# Altium schematic sheet Power Supply.SchDoc: Power Supply
size Letter; Author: Alfredo Cortellini; Organization: IT Logic; Address1: 5753 Highway 85 N; Address2: Crestview, FL 32536; Address3: United States; DocumentNumber: 6; SheetNumber: 6; SheetTotal: 6; Email: pcb-design@itlogic.cloud
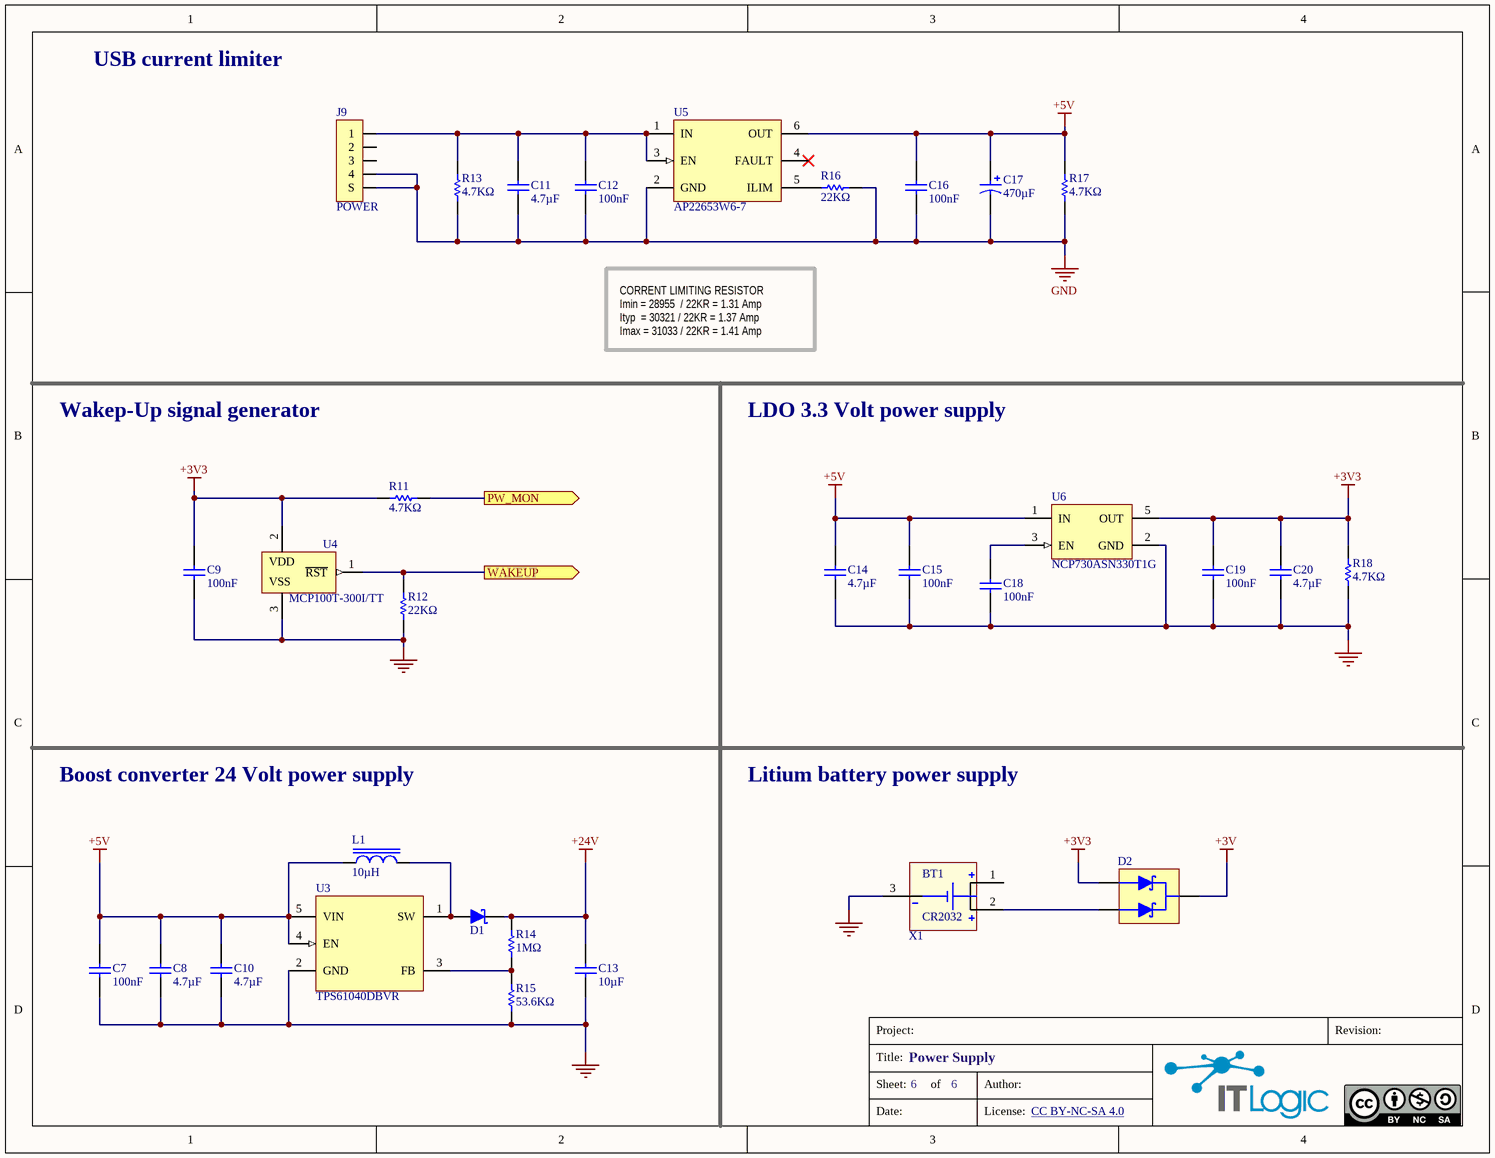
[diagram p0: Power Supply.SchDoc]

## Parts
BT1  CR2032  (mechanical)
C7  100nF  [C0603-H90]
C8  4.7µF  [C0603-H90]
C9  100nF  [C0603-H90]
C10  4.7µF  [C0603-H90]
C11  4.7µF  [C0603-H90]
C12  100nF  [C0603-H90]
C13  10µF  [C1210-H250]
C14  4.7µF  [C0603-H90]
C15  100nF  [C0603-H90]
C16  100nF  [C0603-H90]
C17  470µF  [C-AE-D8-H102]
C18  100nF  [C0603-H90]
C19  100nF  [C0603-H90]
C20  4.7µF  [C0603-H90]
D1  ZLLS400QTC  [SOD-323]  (value not drawn)
D2  BAT5405E6327HTSA1  [SOT-23]  (value not drawn)
J9  POWER  [67068-8000]
L1  10µH  [IND-LQH43CN]
R11  4.7KΩ  [R0603-H55]
R12  22KΩ  [R0603-H55]
R13  4.7KΩ  [R0603-H55]
R14  1MΩ  [R0603-H55]
R15  53.6KΩ  [R0603-H55]
R16  22KΩ  [R0603-H55]
R17  4.7KΩ  [R0603-H55]
R18  4.7KΩ  [R0603-H55]
U3  TPS61040DBVR  [SOT-235]
U4  MCP100T-300I/TT  [SOT-23]
U5  AP22653W6-7  [SOT-236]
U6  NCP730ASN330T1G  [SOT-235]
X1  BAT-HLD-001  [BATT-TRAY-2032]  (value not drawn)

## Ports
PW_MON (out), WAKEUP (out)

## Nets
+3V: D2.3(K)
+3V3: C9.2 C19.2 C20.2 D2.1(A) R11.2 R18.2 U4.2(VDD) U6.5(OUT)
+5V: C7.2 C8.2 C10.2 C14.2 C15.2 C16.2 C17.1 L1.1 R17.2 U3.4(EN) U3.5(VIN) U5.6(OUT) U6.1(IN)
+24V: C13.2 D1.1(K) R14.2
GND: C7.1 C8.1 C9.1 C10.1 C11.1 C12.1 C13.1 C14.1 C15.1 C16.1 C17.2 C18.1 C19.1 C20.1 J9.4 J9.S R12.1 R13.1 R15.1 R16.2 R17.1 R18.1 U3.2(GND) U4.3(VSS) U5.2(GND) U6.2(GND) X1.3(-)
PW_MON: R11.1 ; port PW_MON
WAKEUP: R12.2 U4.1(~{RST}) ; port WAKEUP
NetC11_2: C11.2 C12.2 J9.1 R13.2 U5.1(IN) U5.3(EN)
NetC18_2: C18.2 U6.3(EN)
NetD1_2: D1.2(A) L1.2 U3.1(SW)
NetD2_2: D2.2(A) X1.2(+)
NetR14_1: R14.1 R15.2 U3.3(FB)
NetR16_1: R16.1 U5.5(ILIM)

Not connected (* = marked no-connect by the designer): J9 2 3; U5 4(FAULT)*; X1 1(+)

## Notes on the sheet
- USB current limiter
- CORRENT LIMITING RESISTOR
  Imin = 28955  / 22KR = 1.31 Amp
  Ityp  = 30321 / 22KR = 1.37 Amp
  Imax = 31033 / 22KR = 1.41 Amp
- Wakep-Up signal generator
- LDO 3.3 Volt power supply
- Boost converter 24 Volt power supply
- Litium battery power supply
- Project:
- Revision:
- Title:
- Sheet:
- of
- Author:
- Date:
- License:
- CC BY-NC-SA 4.0 <https://creativecommons.org/licenses/by-nc-sa/4.0/>

## Library data of the parts
BT1 = CR2032: Battery Lithium 3V Coin 20mm; Manufacturer: Panasonic BSG; Manufacturer Part Number: CR2032; Mount: Free Hanging; Voltage Rating: 3V; ComponentLink1URL: https://datasheet.ciiva.com/2/crseries-datasheets-merged-2903.pdf; ComponentLink1Description: Data Sheet
C7 C9 C12 C15 C16 C18 C19 = CGA3E2X7R1H104K080AA: Cap 0603 Case Ceramic 100nF 50V X7R; Manufacturer: TDK; Value: 100n; Manufacturer Part Number: CGA3E2X7R1H104K080AA; Mount: Surface Mount; Case: 0603; Capacitance: 100nF; Dielectric: X7R; Voltage Rating: 50V; ComponentLink1URL: https://product.tdk.com/system/files/dam/doc/product/capacitor/ceramic/mlcc/catalog/mlcc_commercial_general_en.pdf; ComponentLink1Description: Data Sheet
C8 C10 C11 C14 C20 = C1608X7S1A475K080AC: Cap 0603 Case Ceramic 4.7uF 10V X7S; Manufacturer: TDK; Voltage Rating: 50V; Value: 4.7u; Manufacturer Part Number: C1608X7S1A475K080AC; Mount: Surface Mount; Case: 0603; Capacitance: 4.7uF; Dielectric: X7S; ComponentLink1URL: https://product.tdk.com/system/files/dam/doc/product/capacitor/ceramic/mlcc/catalog/mlcc_commercial_general_en.pdf; ComponentLink1Description: Data Sheet
C13 = CL32B106KBJNNWE: Cap 1210 Case Ceramic 10uF 50V X7R 10%; Manufacturer: Samsung; Dielectric: X7S; Value: 10u; Manufacturer Part Number: CL32B106KBJNNWE; Mount: Surface Mount; Case: 1210; Capacitance: 10uF; Voltage Rating: 50V; ComponentLink1URL: https://www.mouser.com/datasheet/2/585/MLCC-1837944.pdf; ComponentLink1Description: Data Sheet
C17 = EEE-FK1C471P: Cap Electrolytic Alu 470uF 16V 20% (10 X 10.2mm) SMD 600mA 2000h 105C Automotive T/R; Manufacturer: Panasonic; Resistance: 0.16R; Value: 470u; Manufacturer Part Number: EEE-FK1C471P; Mount: Surface Mount; Capacitance: 470uF; Voltage Rating: 16V; ComponentLink1URL: https://datasheet.ciiva.com/3773/41677623s8437994n1386-3773397.pdf; ComponentLink1Description: Data Sheet; Case: F
D1 = ZLLS400QTC: Diode Schottky 40V 0.5A, Vf 480mV, 2-Pin SOD323; Manufacturer: Diodes Incorporated; Manufacturer Part Number: ZLLS400QTC; Mount: Surface Mount; Case: SOD323; Current Rating: 0.5A; ComponentLink1URL: https://eu.mouser.com/datasheet/2/115/ZLLS400Q-959647.pdf; ComponentLink1Description: Data Sheet
D2 = BAT5405E6327HTSA1: Diode Schottky, Common cathode, 40V 0.3A 3-Pin SOT-323; Manufacturer: Infineon Technologies; Manufacturer Part Number: BAT5405E6327HTSA1; Mount: Surface Mount; Case: SOT-23; Current Rating: 0.3A; ComponentLink1URL: https://www.infineon.com/dgdl/Infineon-BAT54SERIES-DS-v01_01-en.pdf?fileId=db3a304314dca3890115190b74210ea6; ComponentLink1Description: Data Sheet
J9 = 67068-8000: Conn USB Type B Right-Angle, Kinked Solder Tabs; Manufacturer: Molex; Voltage Rating: 30V; Current Rating: 1.5A; Manufacturer Part Number: 67068-8000; Mount: Through Hole; ComponentLink1URL: https://www.molex.com/pdm_docs/sd/670688000_sd.pdf; ComponentLink1Description: Data Sheet
L1 = LQH43CN100K03L: Inductor Power LQH43CN Series, 10uH, 0.65 A, 0.24 ohm, SMD; Manufacturer: Murata; Value: 10u; Manufacturer Part Number: LQH43CN100K03L; Inductance: 10µH; ComponentLink1URL: https://search.murata.co.jp/Ceramy/image/img/P02/JELF243A-0042.pdf; ComponentLink1Description: Data Sheet; Mount: Surface Mount
R11 R13 R17 R18 = RC0603FR-074K7L: Resistor 0603 Case 4.7KR 1% 1/10W; Manufacturer: Yageo; Voltage Rating: 150V; Value: 4.7K; Manufacturer Part Number: RC0603FR-074K7L; Case: 0603; Resistance: 4.7kR; ComponentLink1URL: https://datasheet.ciiva.com/11808/0900766b8106beab-11808155.pdf; ComponentLink1Description: Data Sheet; Mount: Surface Mount
R12 R16 = RC0603FR-0722KL: Resistor 0603 Case 22KR 1% 1/10W; Manufacturer: Yageo; Voltage Rating: 150V; Value: 22K; Manufacturer Part Number: RC0603FR-0722KL; Case: 0603; Resistance: 22kR; ComponentLink1URL: https://datasheet.ciiva.com/2457/pyu-r-int-thick-7-2457521.pdf; ComponentLink1Description: Data Sheet; Mount: Surface Mount
R14 = RC0603FR-071ML: Resistor 0603 Case 1MR 1% 1/10W; Manufacturer: Yageo; Voltage Rating: 150V; Value: 1M; Manufacturer Part Number: RC0603FR-071ML; Case: 0603; Resistance: 1MR; ComponentLink1URL: https://datasheet.ciiva.com/2519/pyu-r-int-thick-7-2519712.pdf; ComponentLink1Description: Data Sheet; Mount: Surface Mount
R15 = RC0603FR-0753K6L: Resistor 0603 Case 53.6KR 1% 1/10W; Manufacturer: Yageo; Voltage Rating: 150V; Value: 53.6K; Manufacturer Part Number: RC0603FR-0753K6L; Case: 0603; Resistance: 53.6kR; ComponentLink1URL: https://datasheet.ciiva.com/2457/pyu-r-int-thick-7-2457521.pdf; ComponentLink1Description: Data Sheet; Mount: Surface Mount
U3 = TPS61040DBVR: Conv DC-DC Sync Step-Up 28V .45A 1MHz SOT-23-5; Manufacturer: Texas Instruments; Manufacturer Part Number: TPS61040DBVR; Mount: Surface Mount; Case: STO-235; ComponentLink1URL: http://www.ti.com/lit/ds/symlink/tps54308.pdf; ComponentLink1Description: Data Sheet
U4 = MCP100T-300I/TT: Power Supervisor 3.00V Low SOT23; Manufacturer: Microchip; Manufacturer Part Number: MCP100T-300I/TT; Mount: Surface Mount; Case: SOT-23-3; ComponentLink1URL: https://ww1.microchip.com/downloads/en/DeviceDoc/11187f.pdf; ComponentLink1Description: Data Sheet
U5 = AP22653W6-7: Smart High-Side Power Distribution Switches, 1 Output, 5.5V, Adjustable current limit 2.1A Max, Rdson 65mΩ, SOT-23-6; Manufacturer: Diodes Incorporated; Manufacturer Part Number: AP22653W6-7; Mount: Surface Mount; Case: SOT-23-6; ComponentLink1URL: https://www.diodes.com/assets/Datasheets/AP22652_53_52A_53A.pdf; ComponentLink1Description: Data Sheet
U6 = NCP730ASN330T1G: LDO 3.3V 150mA Out  38Vin 290mV Dropout, Quiescent current 1 uA SOT-23-5; Manufacturer: ON Semiconductor; Manufacturer Part Number: NCP730ASN330T1G; Mount: Surface Mount; Case: SOT-23-5; ComponentLink1URL: https://eu.mouser.com/datasheet/2/308/1/NCP730_D-2317345.pdf; ComponentLink1Description: Data Sheet
X1 = BAT-HLD-001: Holder Battery Coin 20mm; Manufacturer: Linx; Manufacturer Part Number: BAT-HLD-001; Mount: Surface Mount; ComponentLink1URL: https://datasheet.ciiva.com/4/bat-hld-001-4035.pdf; ComponentLink1Description: Data Sheet